# Altium schematic sheet current sensors.SchDoc
size A
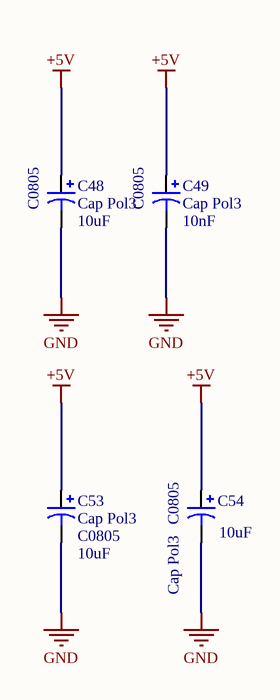
[diagram p0: current sensors.SchDoc]

## Parts
C48  Cap Pol3  value 10uF  [C0805]
C49  Cap Pol3  value 10nF  [C0805]
C53  Cap Pol3  value 10uF  [C0805]
C54  Cap Pol3  value 10uF  [C0805]

## Nets
+5V: C48.1 C49.1 C53.1 C54.1
GND: C48.2 C49.2 C53.2 C54.2

## Library data of the parts
C48 C49 C53 C54 = Cap Pol3: Polarized Capacitor (Surface Mount); Published: 8-Jun-2000; LatestRevisionDate: 29-May-2009; LatestRevisionNote: IPC-7351 Footprint Added.; PackageReference: C0805; Publisher: Altium Limited; PackageDescription: Chip Capacitor